# Altium schematic sheet ALIMENTATION_PLEIADES.SchDoc
size Tabloid; SheetNumber: 2; SheetTotal: 5; Sheet_Name: Insert name in Document Parameters; Size: 11x17
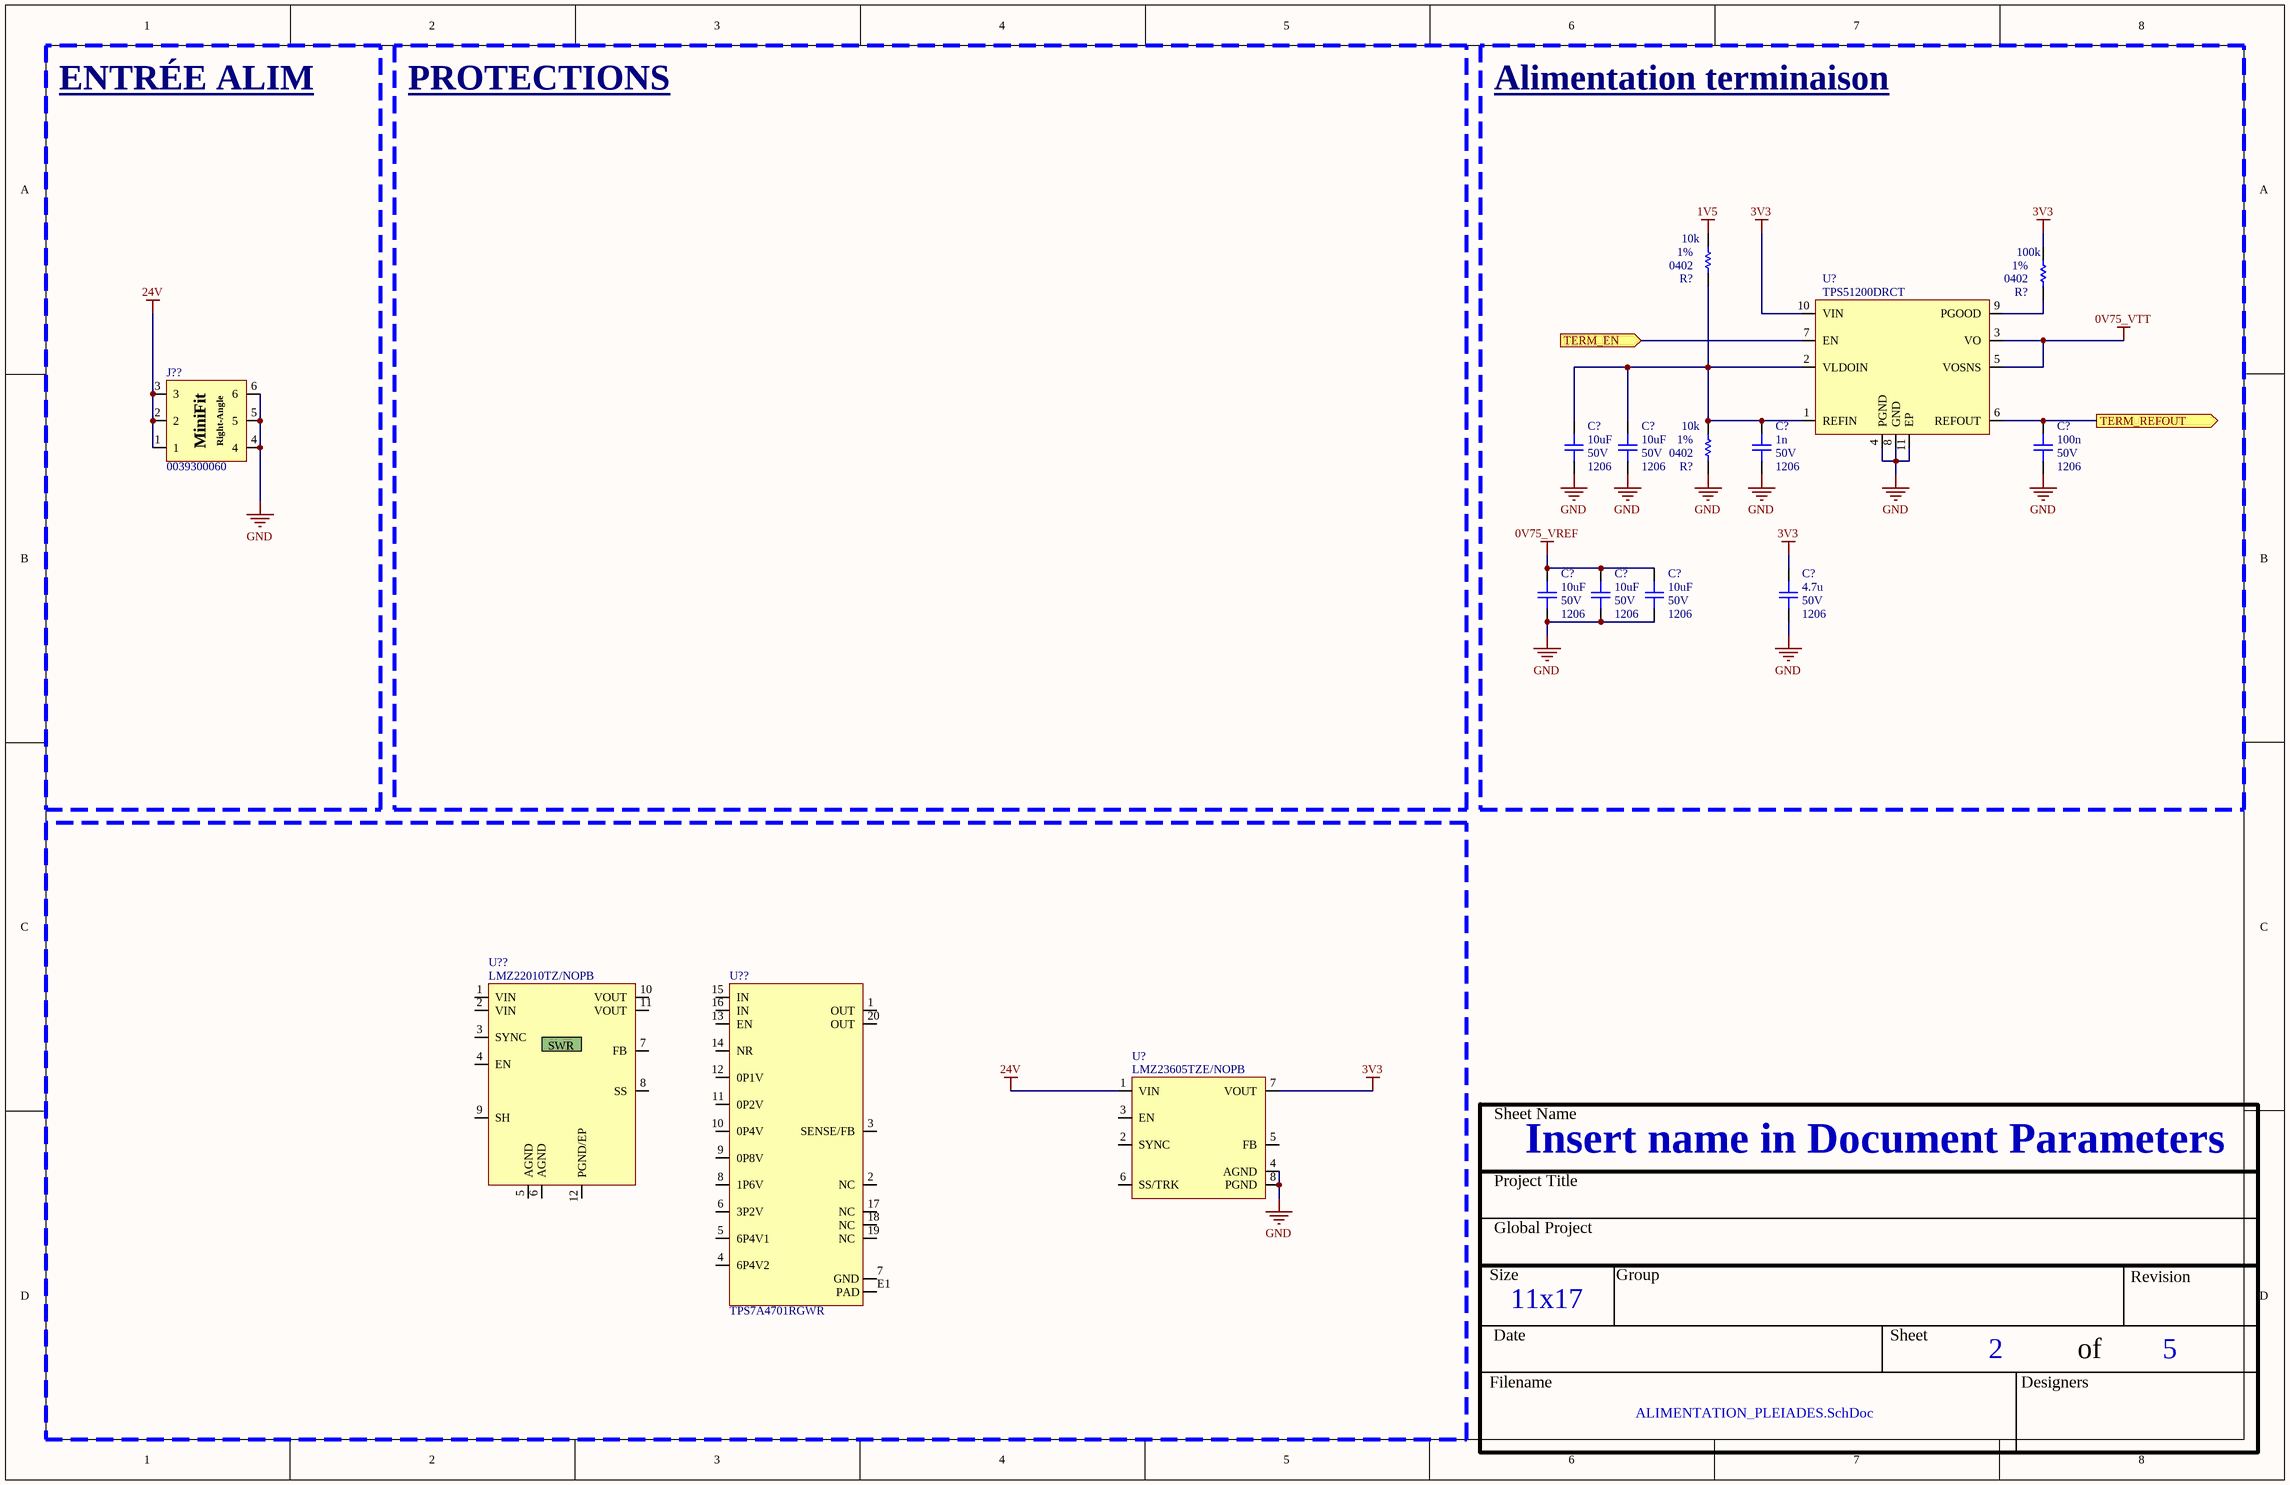
[diagram p0: ALIMENTATION_PLEIADES.SchDoc]

## Parts
(Parts that share a designator on the sheet are numbered #1, #2 ... from top to bottom, then left to right.)
C?#1  value 10uF  Voltage: 50V  Package: 1206  [CAP_1206]  (hidden comment: CAP - 1206)
C?#2  value 10uF  Voltage: 50V  Package: 1206  [CAP_1206]  (hidden comment: CAP - 1206)
C?#3  value 1n  Voltage: 50V  Package: 1206  [CAP_1206]  (hidden comment: CAP - 1206)
C?#4  value 100n  Voltage: 50V  Package: 1206  [CAP_1206]  (hidden comment: CAP - 1206)
C?#5  value 10uF  Voltage: 50V  Package: 1206  [CAP_1206]  (hidden comment: CAP - 1206)
C?#6  value 10uF  Voltage: 50V  Package: 1206  [CAP_1206]  (hidden comment: CAP - 1206)
C?#7  value 10uF  Voltage: 50V  Package: 1206  [CAP_1206]  (hidden comment: CAP - 1206)
C?#8  value 4.7u  Voltage: 50V  Package: 1206  [CAP_1206]  (hidden comment: CAP - 1206)
J??  0039300060  [CON_MINIFIT_0039300060]
R?#1  value 10k  Package: 0402  Precision: 1%  [RES_0402]  (hidden comment: RES - 0402)
R?#2  value 100k  Package: 0402  Precision: 1%  [RES_0402]  (hidden comment: RES - 0402)
R?#3  value 10k  Package: 0402  Precision: 1%  [RES_0402]  (hidden comment: RES - 0402)
U?#1  TPS51200DRCT  [REG_PMIC_TPS51200DRCT]
U?#2  LMZ23605TZE/NOPB  [REG_SWR_LMZ23605TZE/NOPB]
U??#1  LMZ22010TZ/NOPB  [REG_SWR_LMZ22010TZ/NOPB]
U??#2  TPS7A4701RGWR  [REG_TPS7A4701RGWR]

## Blocks framed on the sheet
ENTRÉE ALIM: J??
Alimentation terminaison: C?#1-C?#8 R?#1-R?#3 U?#1

## Ports
TERM_EN (in), TERM_REFOUT (out)

## Nets
0V75_VREF: C?#5.2 C?#6.2 C?#7.2
0V75_VTT: U?#1.3(VO) U?#1.5(VOSNS)
1V5: R?#1.1
3V3: C?#8.2 R?#2.1 U?#1.10(VIN) U?#2.7(VOUT)
24V: J??.1 J??.2 J??.3 U?#2.1(VIN)
GND: C?#1.1 C?#2.1 C?#3.1 C?#4.1 C?#5.1 C?#6.1 C?#7.1 C?#8.1 J??.4 J??.5 J??.6 R?#3.2 U?#1.4(PGND) U?#1.8(GND) U?#1.11(EP) U?#2.4(AGND) U?#2.8(PGND)
TERM_EN: U?#1.7(EN) ; port TERM_EN
TERM_REFOUT: C?#4.2 U?#1.6(REFOUT) ; port TERM_REFOUT
NetC?#1_2: C?#1.2 C?#2.2 C?#3.2 R?#1.2 R?#3.1 U?#1.1(REFIN) U?#1.2(VLDOIN)
NetR?#2_2: R?#2.2 U?#1.9(PGOOD)

Not connected (* = marked no-connect by the designer): U?#2 2(SYNC) 3(EN) 5(FB) 6(SS/TRK); U??#1 1(VIN) 2(VIN) 3(SYNC) 4(EN) 5(AGND) 6(AGND) 7(FB) 8(SS) 9(SH) 10(VOUT) 11(VOUT) 12(PGND/EP); U??#2 1(OUT) 2(NC) 3(SENSE/FB) 4(6P4V2) 5(6P4V1) 6(3P2V) 7(GND) 8(1P6V) 9(0P8V) 10(0P4V) 11(0P2V) 12(0P1V) 13(EN) 14(NR) 15(IN) 16(IN) 17(NC) 18(NC) 19(NC) 20(OUT) E1(PAD)

## Notes on the sheet
- PROTECTIONS
- Sheet Name
- Project Title
- Global Project
- Size
- Group
- Revision
- Date
- Sheet
- of
- Filename
- Designers
- (in symbol CON_MINIFIT_0039300060) MiniFit; Right-Angle
- (in symbol REG_SWR_LMZ22010TZ/NOPB) SWR

## Library data of the parts
C?#1-C?#8 = CAP - 1206: Precision: 10%; Current: *; CreatedBy: Jonathan Bouchard; Power: *
J?? = CON_MINIFIT_0039300060: CON - Mini-Fit Through Hole, Right Angle 6 position; Manufacturer #1: Molex; Current Rating: 8A; GRAMS Lib Spec: 2.8; Magnetic Material: Unknown; Polarized: Yes; Voltage Rating: 600V; Assembly Type: TH; CreatedBy/Date: Joel Lemay 2018-06-21; HelpURL: https://www.molex.com/pdm_docs/sd/039300060_sd.pdf; Manufacturer #2: *; Package: TH; Part Number #1: 0039300060; Part Number #2: *; Power Max: *; Supplier 1: Digi-Key; Supplier Part Number 1: WM21353-ND; Temperature: - 40°C to + 80°C; Tolerance: *; Value: *; VerifiedBy: Caroline Paulin - 10 sept 2018; Cryo: UNKNOWN
R?#1-R?#3 = RES - 0402: Voltage: 50V; Power: 1/16W; Current: *; CreatedBy: Jonathan Bouchard
U?#1 = REG_PMIC_TPS51200DRCT: REG - DDR TERMINATION/REF REG - 10-VFDFN; Manufacturer #1: Texas Instruments; Value: DDR, DDR2, DDR3(L), DDR4; Voltage Rating: 2.375V ~ 3.5V; Current Rating: Source: 3A~4.5A, Sink: 3.5A~5.5A; GRAMS Lib Spec: 2.8; Magnetic Material: Unknown; Polarized: Yes; Tolerance: *; Power Max: *; HelpURL: http://www.ti.com/lit/ds/symlink/tps51200.pdf; CreatedBy/Date: Joel Lemay 2019-03-19; VerifiedBy: Nicolas V. (2019-05-31); Temperature: -40°C ~ 85°C; Package: 10-VFDFN; Manufacturer #2: *; Note: *; Assembly Type: SMD; Part Number #2: *; Part Number #1: TPS51200DRCT; Supplier 1: Digi-Key; Supplier Part Number 1: 296-23830-1-ND; Cryo: UNKNOWN
U?#2 = REG_SWR_LMZ23605TZE/NOPB: REG - IC BUCK SYNC 36V 5A - TO-PMOD-7; Manufacturer #1: Texas Instruments; Value: 0.8 ~ 6 V; Voltage Rating: 6 ~ 36 V; GRAMS Lib Spec: 2.8; Note: One Reflow; Magnetic Material: YES; Cryo: UNKNOWN; Tolerance: *; Current Rating: 5A; Power Max: *; HelpURL: http://www.ti.com/lit/ds/symlink/lmz23605.pdf; CreatedBy/Date: Arnaud Samson - 05/07/18; VerifiedBy: Jonathan Bouchard 2018-07-13; Temperature: -40°C ~ 125°C; Package: TO-PMOD-7; Manufacturer #2: *; Assembly Type: SMD; Part Number #2: *; Part Number #1: LMZ23605TZE/NOPB; Polarized: YES; Supplier 1: Digi-Key; Supplier Part Number 1: 296-35357-1-ND
U??#1 = REG_SWR_LMZ22010TZ/NOPB: REG - DC DC Converter 0.8 to 6V 10A - TO-PMOD-11; Manufacturer #1: Texas Instruments; Value: 0.8V~6V; Voltage Rating: 6 - 20V; Power Max: 60W; GRAMS Lib Spec: 2.8c; Magnetic Material: Unknown; Polarized: Yes; Tolerance: *; Current Rating: 10A; HelpURL: http://www.ti.com/lit/ds/symlink/lmz22010.pdf; CreatedBy/Date: P.Marcoux  20-06-2019; VerifiedBy: C.Paulin - 21/01/2020; Temperature: -40°C ~ 125°C; Package: TO-PMOD-11; Manufacturer #2: *; Note: *; Assembly Type: SMD; Part Number #2: *; Part Number #1: LMZ22010TZ/NOPB; Supplier 1: Digi-Key; Supplier Part Number 1: LMZ22010TZ/NOPB-ND; Cryo: UNKNOWN
U??#2 = REG_LDO_TPS7A4701RGWR: REG - LINEAR POS ADJ 1A - 20VQFN; Manufacturer #1: Texas Instruments; GRAMS Lib Spec: 2.8; Magnetic Material: Unknown; Polarized: Yes; Value: 1.4 à 34V; Voltage rating: 35V max; Assembly Type: SMD; CreatedBy/Date: L-P Gauthier / 2018-05-29; Current Rating: 1A; Manufacturer #2: TBD; Part Number #1: TPS7A4701RGWR; Part Number #2: TBD; Package: 20-VQFN Exposed Pad; Power Max: *; Tolerance: -; Supplier 1: Digi-Key; Supplier Part Number 1: 296-37224-1-ND; VerifiedBy: Caroline Paulin - 28 sept 2018; Temperature: -40°C ~ 125°C; HelpURL: http://www.ti.com/lit/ds/symlink/tps7a47.pdf; Cryo: UNKNOWN